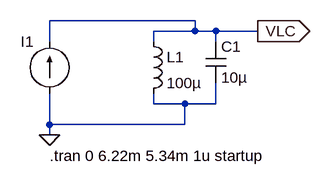
[diagram p0: schematic LC Parallel 7circuit.asc]
LC Parallel 7circuit.asc, the LTspice schematic file:
Version 4
SHEET 1 880 680
WIRE 416 224 192 224
WIRE 416 240 416 224
WIRE 416 240 352 240
WIRE 448 240 416 240
WIRE 512 240 448 240
WIRE 192 256 192 224
WIRE 352 256 352 240
WIRE 448 256 448 240
WIRE 352 352 352 336
WIRE 400 352 352 352
WIRE 448 352 448 320
WIRE 448 352 400 352
WIRE 192 384 192 336
WIRE 400 384 400 352
WIRE 400 384 192 384
WIRE 192 400 192 384
FLAG 512 240 VLC
IOPIN 512 240 Out
FLAG 192 400 0
SYMBOL current 192 336 R180
WINDOW 0 24 80 Left 2
WINDOW 3 24 0 Invisible 2
WINDOW 123 0 0 Left 0
WINDOW 39 0 0 Left 0
SYMATTR InstName I1
SYMATTR Value PULSE(0 1v 0 1us 1us .999ms 1.78ms)
SYMBOL ind 336 240 R0
SYMATTR InstName L1
SYMATTR Value 100µ
SYMATTR SpiceLine Ipk=1 Rser=85m Rpar=infin. Cpar=0 mfg="Coiltronics" pn="CTX100-1-52"
SYMBOL cap 432 256 R0
SYMATTR InstName C1
SYMATTR Value 10µ
TEXT 192 432 Left 2 !.tran 0 6.22m 5.34m 1u startup

The netlist it stands for:
* LC Parallel 7circuit.asc
I1 0 VLC PULSE(0 1v 0 1us 1us .999ms 1.78ms)
L1 VLC 0 100µ Ipk=1 Rser=85m Rpar=infin. Cpar=0 mfg="Coiltronics" pn="CTX100-1-52"
C1 VLC 0 10µ
.tran 0 6.22m 5.34m 1u startup
.backanno
.end